# EasyEDA Pro project ProPrj_工创赛_2026-09-08.epro, board PCB1
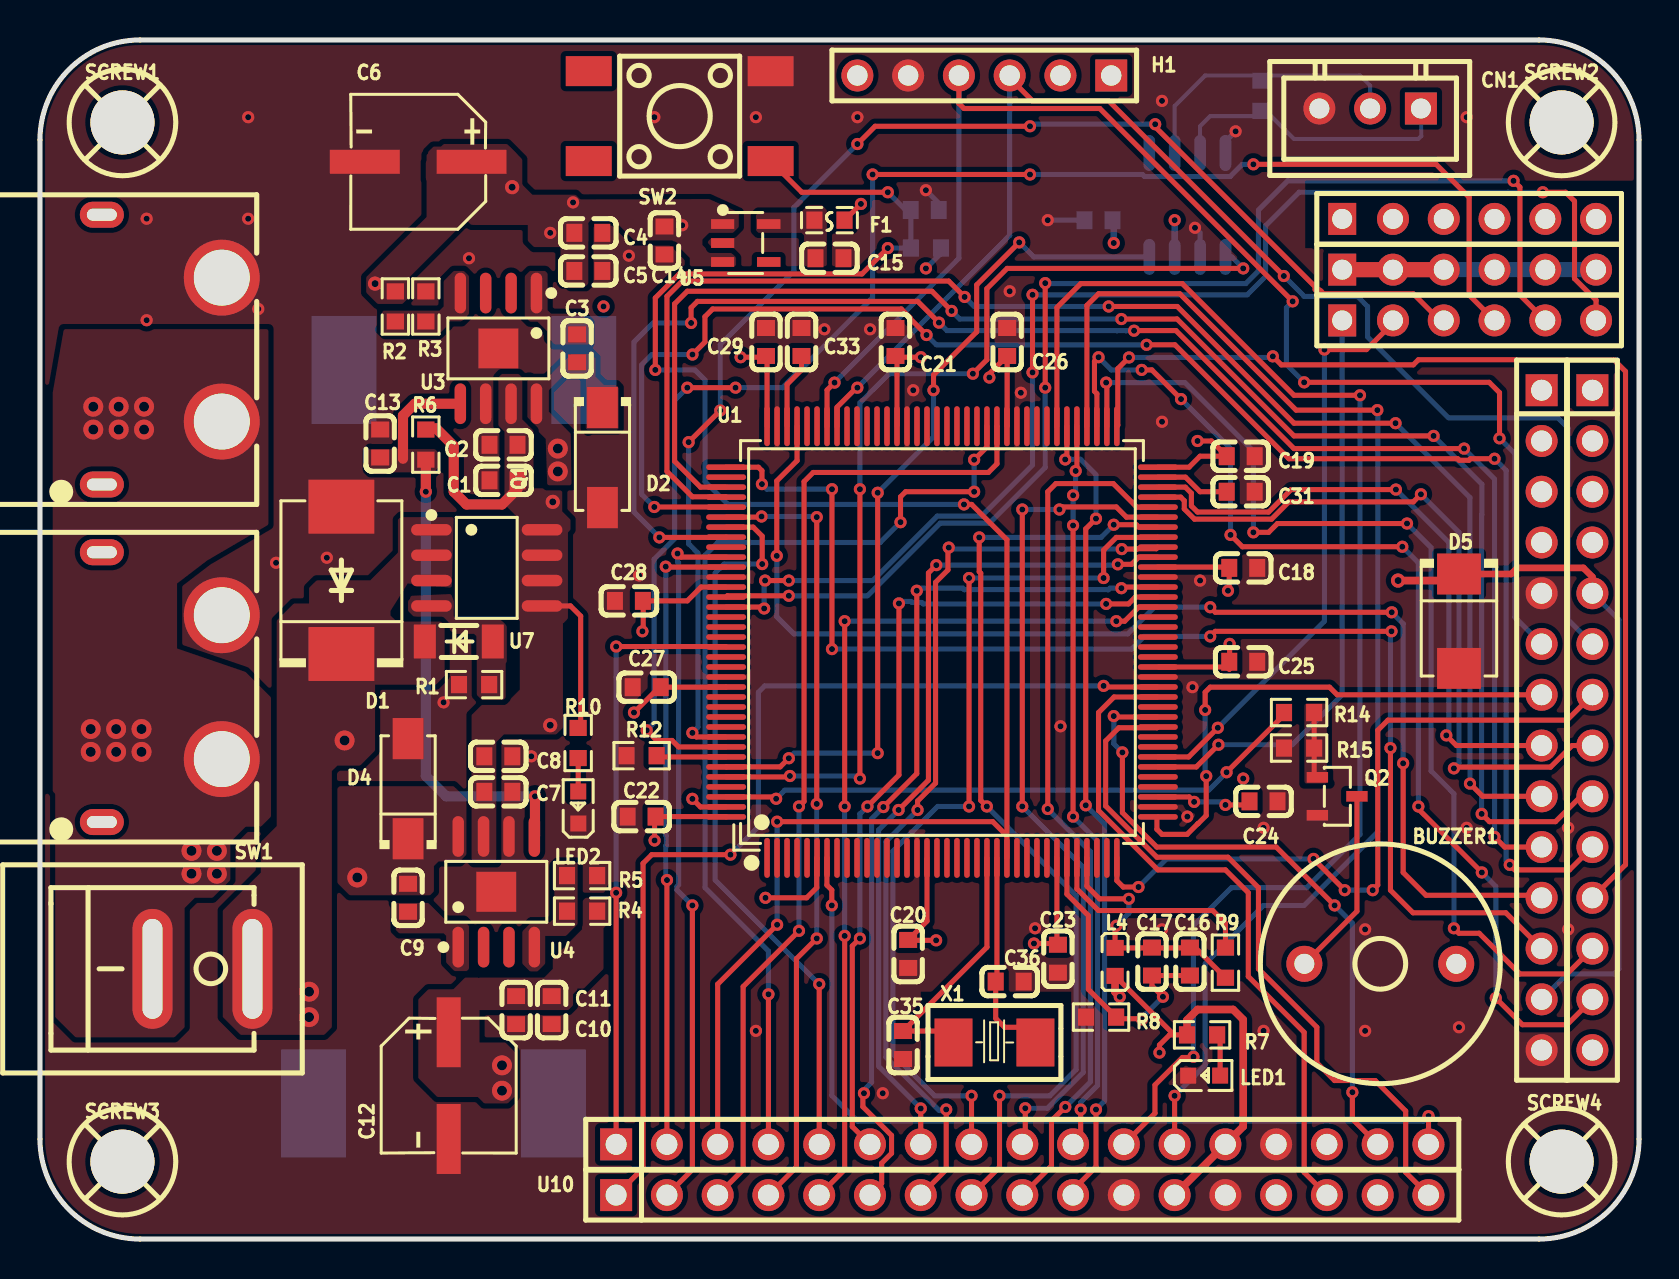
[diagram p3: board, top side]
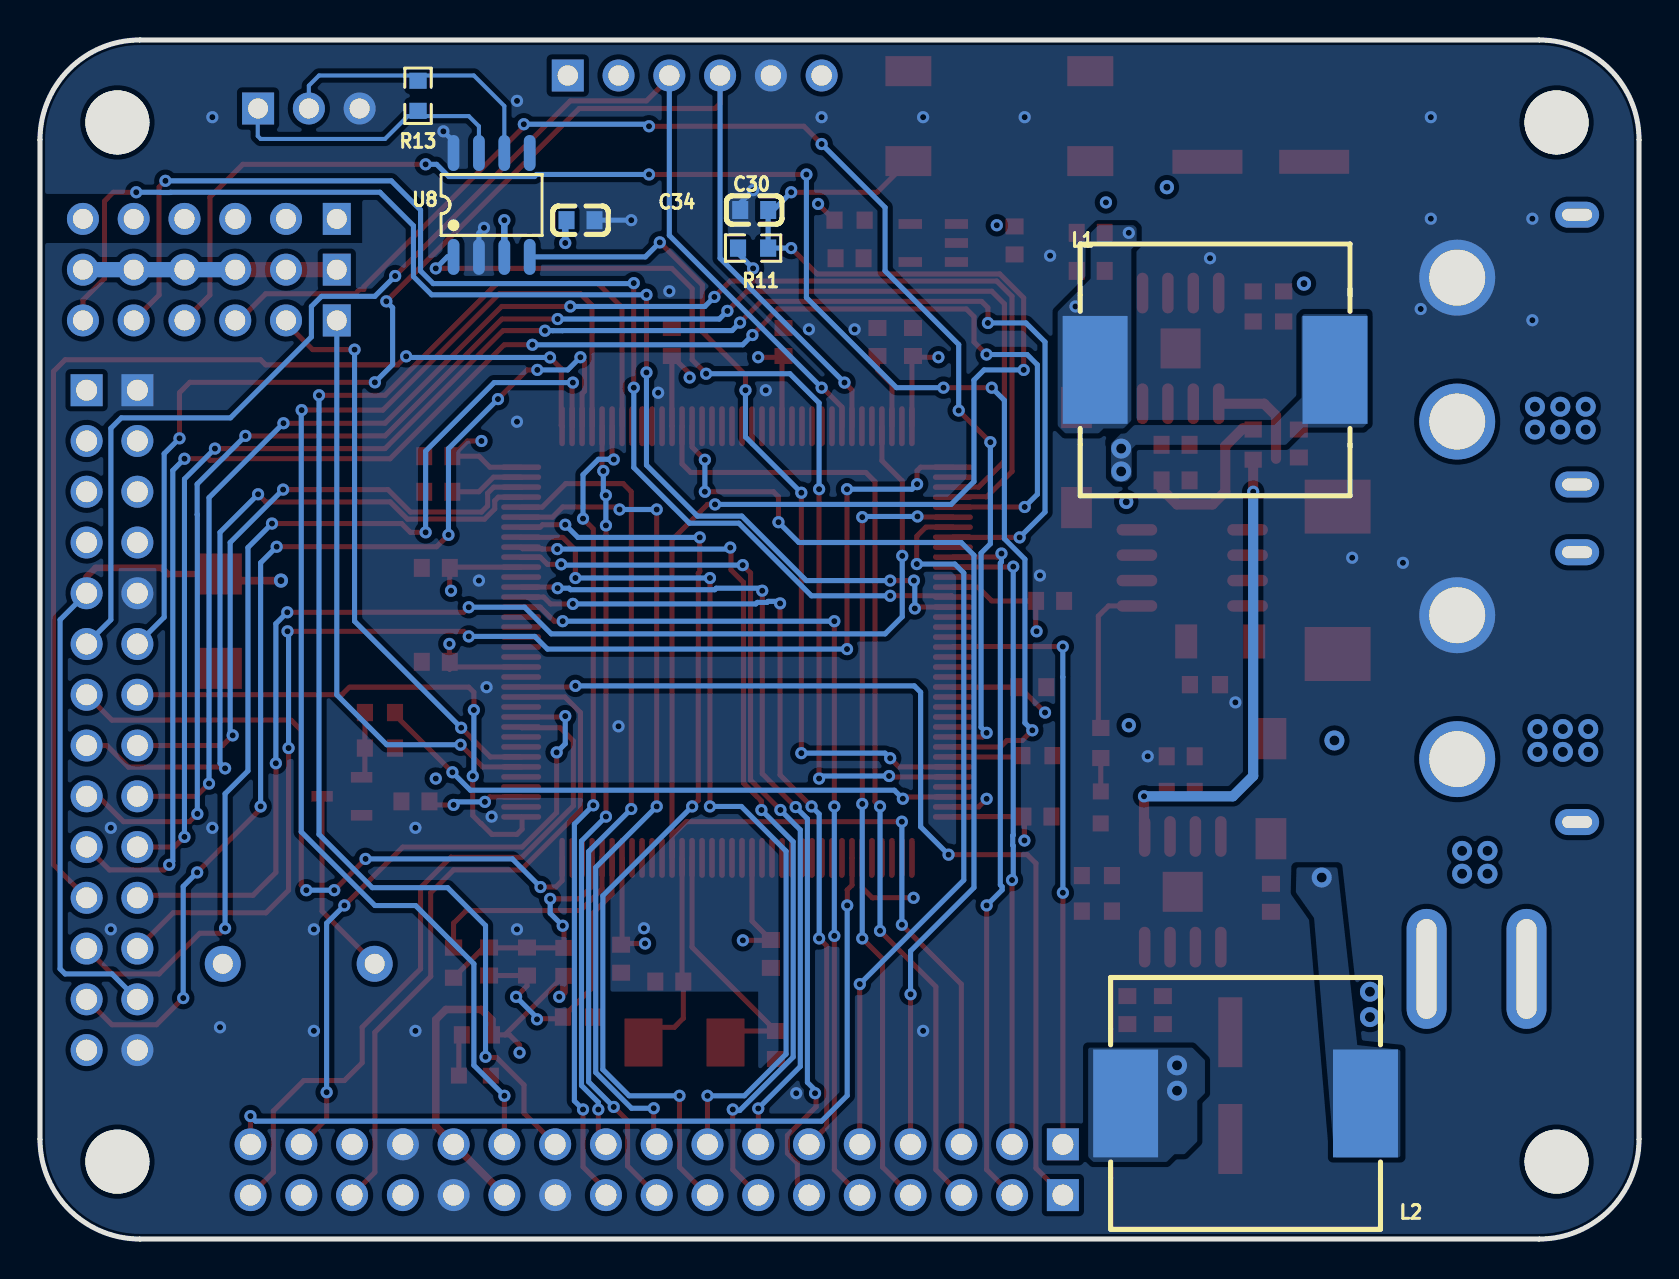
[diagram p4: board, bottom side, seen from below]

Outline 80 x 60 mm; copper layers: Top Layer, GND, POWER, Bottom Layer. Coordinates in mm from the lower left corner of the outline.
Outline path: 0,55 0,5 arc(1.46,1.46) 5,0 75,0 arc(78.54,1.46) 80,5 80,55 arc(78.54,58.54) 75,60 5,60 arc(1.46,58.54) 0,55
Stack: Top Layer 0.035mm Outer layer thickness 1oz / Dielectric1 0.2104mm 7628 RC49% 8.6mil / GND 0.0152mm Inner layer thickness / Dielectric2 1.065mm 1.1mm H/HOZ Copper / POWER 0.0152mm Inner layer thickness / Dielectric3 0.2104mm 7628 RC49% 8.6mil / Bottom Layer 0.035mm Outer layer thickness 1oz

## Design rules (mm)
spacing copperThickness1oz (default): track to track 0.102, other pairs 0.152 to 0.3
spacing copperThickness2oz: track to track 0.203, other pairs 0.152 to 0.3
track width copperThickness1oz (default): min 0.127, default 0.254, max 2.54
track width copperThickness2oz: min 0.203, default 0.254, max 2.54
differential pair differentialPair (default): width min 0.203, default 0.203, max 2.54; gap min 0.203, default 0.203
net GND-D uses copperRegion
net VIN-D uses copperRegion
net $1N20 uses copperRegion
net $1N19 uses copperRegion
net 5V uses copperRegion
net $1N35 uses copperRegion
net $1N36 uses copperRegion
net 5V_5A uses copperRegion
net EN_1 uses copperRegion
net $1N46 uses copperRegion
net $1N16 uses copperRegion
net FB1 uses copperRegion
net FB2 uses copperRegion
net VIN-P uses copperRegion

## Placement (name value [footprint] x y rotation side)
BUZZER1  2.4kHz  [BUZ-TH_BD12.0-P7.60-D0.6-FD]  67.06 13.77 180 top
C1  22uF  [C0603]  23.19 37.96 180 top
C2  0.1uF  [C0603]  23.19 39.74 180 top
C3  10nF  [C0603]  26.87 44.57 90 top
C4  22uF  [C0603]  27.43 50.35 180 top
C5  100nF  [C0603]  27.43 48.44 180 top
C6  220uF  [CAP-SMD_BD6.3-L6.6-W6.6-FD]  18.92 53.9 180 top
C7  22uF  [C0603]  22.93 22.38 0 top
C8  0.1uF  [C0603]  22.93 24.15 0 top
C9  10nF  [C0603]  18.42 17.07 270 top
C10  22uF  [C0603]  23.82 11.45 90 top
C11  100nF  [C0603]  25.6 11.45 90 top
C12  220uF  [CAP-SMD_BD6.3-L6.6-W6.6-FD]  20.45 7.68 270 top
C13  100nF  [C0603]  17.02 39.81 90 top
C14  1uF  [C0603]  31.24 49.97 90 top
C15  1uF  [C0603]  39.5 49.08 180 top
C16  1uF  [C0603]  57.53 13.88 90 top
C17  100nF  [C0603]  55.63 13.88 90 top
C18  100nF  [C0603]  60.2 33.58 180 top
C19  100nF  [C0603]  60.07 39.17 180 top
C20  100nF  [C0603]  43.43 14.27 90 top
C21  100nF  [C0603]  42.8 44.89 270 top
C22  100nF  [C0603]  30.1 21.14 0 top
C23  100nF  [C0603]  50.93 14.03 90 top
C24  100nF  [C0603]  61.21 21.9 180 top
C25  100nF  [C0603]  60.2 28.88 180 top
C26  100nF  [C0603]  48.39 44.89 270 top
C27  100nF  [C0603]  30.35 27.61 0 top
C28  100nF  [C0603]  29.46 31.93 0 top
C29  100nF  [C0603]  36.32 44.89 270 top
C30  100nF  [C0603]  44.27 51.49 0 bottom
C31  2.2uF  [C0603]  60.07 37.39 180 top
C33  2.2uF  [C0603]  38.1 44.89 270 top
C34  100nF  [C0603]  52.96 50.98 0 bottom
C35  20pF  [C0603]  43.18 9.71 90 top
C36  20pF  [C0603]  48.51 12.88 180 top
CN1  ZX-XH2.54-3PZZ  [CONN-TH_3P-P2.54_2501S-3P]  66.55 56.57 180 top
D1  SMCJ15A  [SMC_L6.9-W5.9-LS8.0-RD]  15.08 32.96 90 top
D2  SS54  [SMA_L4.4-W2.8-LS5.4-R-RD]  28.14 39.11 270 top
D4  SS54  [SMA_L4.4-W2.8-LS5.4-R-RD]  18.42 22.53 90 top
D5  SMBJ3.3A  [SMB_L4.6-W3.6-LS5.3-RD]  70.99 30.92 270 top
F1  BSMD0603-050-6V  [F0603]  39.5 50.98 0 top
H1  陀螺仪  [HDR-TH_PZ2.54-1X6PZZ-L11.5]  47.24 58.22 180 top
H2  LAIL-PZ2.54-6P-L  [CONN-TH_LAIL-PZ2.54-6P-L]  71.5 45.97 0 top
H3  LAIL-PZ2.54-6P-L  [CONN-TH_LAIL-PZ2.54-6P-L]  71.5 48.51 0 top
H4  LAIL-PZ2.54-6P-L  [CONN-TH_LAIL-PZ2.54-6P-L]  71.5 51.05 0 top
L1  FXL1350-150-M  [IND-SMD_L12.6-W13.5]  21.21 43.49 180 bottom
L2  FXL1350-150-M  [IND-SMD_L12.6-W13.5]  19.68 6.79 180 bottom
L4  BLM18PG121SN1D  [L0603]  53.79 13.87 90 top
LED1  -  [LED_0603]  58.29 8.18 0 top
LED2  -  [LED_0603]  26.92 21.65 90 top
Q1  AO4407A  [SOP-8_L5.0-W4.0-P1.27-LS6.0-BL]  22.35 33.58 270 top
Q2  S8050  [SOT-23-3_L2.9-W1.3-P1.90-LS2.3-BR]  64.9 22.15 180 top
R1  100K  [R0603]  21.72 27.74 0 top
R2  10K  [R0603]  17.78 46.66 90 top
R3  3.16K  [R0603]  19.3 46.66 270 top
R4  10K  [R0603]  27.12 16.41 0 top
R5  3.16K  [R0603]  27.12 18.19 180 top
R6  100K  [R0603]  19.3 39.75 90 top
R7  1K  [R0603]  58.14 10.22 0 top
R8  0  [R0603]  53.09 11.1 0 top
R9  0  [R0603]  59.31 13.83 90 top
R10  2.2K  [R0603]  26.92 24.82 270 top
R11  10K  [R0603]  44.32 49.59 0 bottom
R12  10K  [R0603]  30.1 24.19 0 top
R13  120  [R0603]  61.09 57.21 270 bottom
R14  1K  [R0603]  62.99 26.34 0 top
R15  10K  [R0603]  62.99 24.57 0 top
SCREW1  -  [M3螺丝]  4.13 55.87 0 top
SCREW2  -  [M3螺丝]  76.13 55.87 0 top
SCREW3  -  [M3螺丝]  4.13 3.87 0 top
SCREW4  -  [M3螺丝]  76.13 3.87 0 top
SW1  RS601HL-1010011BB  [SW-TH_RS601HL-1010011BB]  8.13 13.52 180 top
SW2  KH-6X6X5H-STM  [SW-SMD_4P-L6.0-W6.0-P4.50-LS9.0_H5.0]  32 56.19 180 top
U1  STM32F407ZGT6  [LQFP-144_L20.0-W20.0-P0.50-LS22.0-BL]  45.13 29.87 0 top
U2  XT60PW-F  [TH_2P-XT60PW-F]  6.1 27.61 90 top
U3  RT8289GSP  [SOIC-8_L5.0-W4.0-P1.27-LS6.0-BL-EP2.0]  22.93 44.57 180 top
U4  RT8289GSP  [SOIC-8_L5.0-W4.0-P1.27-LS6.0-BL-EP2.0]  22.83 17.37 0 top
U5  RT9013-33GB  [SOT-23-5_L3.0-W1.7-P0.95-LS2.8-BL]  35.31 49.84 270 top
U6  XT60PW-F  [TH_2P-XT60PW-F]  6.1 44.51 90 top
U7  ZMM12V  [LL-34_L3.5-W1.5-RD-2]  20.95 29.9 0 top
U8  SN65HVD230DR  [SOIC-8_L4.9-W3.9-P1.27-LS6.0-BL]  57.4 51.74 180 bottom
U10  PM254-1-17-Z-8.5  [HDR-TH_17P-P2.54-V-F]  49.14 2.2 0 top
U11  LAIL-PM2.54-14P-L  [HDR-TH_LAIL-PM2.54-14P-L]  77.67 25.96 270 top
U12  触摸屏  [HDR-TH_17P-P2.54-V-F]  49.14 4.74 0 top
U13  LAIL-PM2.54-14P-L  [HDR-TH_LAIL-PM2.54-14P-L]  75.13 25.96 270 top
X1  8MHz  [OSC-SMD_L5.0-W3.2]  47.75 9.83 180 top

## Footprints (pads in the part's own frame, mm; a bottom-side part is the same pattern mirrored in y, then rotated)
BUZ-TH_BD12.0-P7.60-D0.6-FD
  round 1.8 hole 1: 1(-3.8,0) 2(3.8,0)
C0603
  rect 0.8x0.9 smd: 1(-0.7,0) 2(0.7,0)
CAP-SMD_BD6.3-L6.6-W6.6-FD
  rect 3.5x1.2 smd: 1(-2.67,0) 2(2.67,0)
CONN-TH_3P-P2.54_2501S-3P
  rect 1.6x1.6 hole 1: 1(-2.54,0)
  round 1.6 hole 1: 2(0,0) 3(2.54,0)
CONN-TH_LAIL-PZ2.54-6P-L
  rect 1.4x1.6 hole 1: 1(-6.35,0)
  round 1.6 hole 1: 2(-3.81,0) 3(-1.27,0) 4(1.27,0) 5(3.81,0) 6(6.35,0)
F0603
  rect 0.806x0.864 smd: 1(-0.753,0) 2(0.753,0)
HDR-TH_17P-P2.54-V-F
  rect 1.6x1.6 hole 1.05: 1(-20.32,0)
  round 1.6 hole 1.05: 2(-17.78,0) 3(-15.24,0) 4(-12.7,0) 5(-10.16,0) 6(-7.62,0) 7(-5.08,0) 8(-2.54,0) 9(0,0) 10(2.54,0) 11(5.08,0) 12(7.62,0) 13(10.16,0) 14(12.7,0) 15(15.24,0) 16(17.78,0) 17(20.32,0)
HDR-TH_LAIL-PM2.54-14P-L
  rect 1.6x1.6 hole 1.05: 1(-16.51,0)
  round 1.6 hole 1.05: 2(-13.97,0) 3(-11.43,0) 4(-8.89,0) 5(-6.35,0) 6(-3.81,0) 7(-1.27,0) 8(1.27,0) 9(3.81,0) 10(6.35,0) 11(8.89,0) 12(11.43,0) 13(13.97,0) 14(16.51,0)
HDR-TH_PZ2.54-1X6PZZ-L11.5
  rect 1.6x1.6 hole 1.02: 1(-6.35,0)
  round 1.6 hole 1.02: 2(-3.81,0) 3(-1.27,0) 4(1.27,0) 5(3.81,0) 6(6.35,0)
IND-SMD_L12.6-W13.5
  rect 3.25x5.4 smd: 1(-6,0) 2(6,0)
L0603
  rect 0.8x0.864 smd: 1(-0.7,0) 2(0.7,0)
LED_0603
  rect 0.8x0.8 smd: 1(-0.851,-0.01) 2(0.75,-0.005)
LL-34_L3.5-W1.5-RD-2
  rect 1.1x1.7 smd: 1(-1.7,0) 2(1.7,0)
LQFP-144_L20.0-W20.0-P0.50-LS22.0-BL
  oval 0.28x2 smd: 1(-8.75,-10.8) 2(-8.25,-10.8) 3(-7.75,-10.8) 4(-7.25,-10.8) 5(-6.75,-10.8) 6(-6.25,-10.8) 7(-5.75,-10.8) 8(-5.25,-10.8) 9(-4.75,-10.8) 10(-4.25,-10.8) 11(-3.75,-10.8) 12(-3.25,-10.8) 13(-2.75,-10.8) 14(-2.25,-10.8) 15(-1.75,-10.8) 16(-1.25,-10.8) 17(-0.75,-10.8) 18(-0.25,-10.8) 19(0.25,-10.8) 20(0.75,-10.8) 21(1.25,-10.8) 22(1.75,-10.8) 23(2.25,-10.8) 24(2.75,-10.8) 25(3.25,-10.8) 26(3.75,-10.8) 27(4.25,-10.8) 28(4.75,-10.8) 29(5.25,-10.8) 30(5.75,-10.8) 31(6.25,-10.8) 32(6.75,-10.8) 33(7.25,-10.8) 34(7.75,-10.8) 35(8.25,-10.8) 36(8.75,-10.8) 73(8.75,10.8) 74(8.25,10.8) 75(7.75,10.8) 76(7.25,10.8) 77(6.75,10.8) 78(6.25,10.8) 79(5.75,10.8) 80(5.25,10.8) 81(4.75,10.8) 82(4.25,10.8) 83(3.75,10.8) 84(3.25,10.8) 85(2.75,10.8) 86(2.25,10.8) 87(1.75,10.8) 88(1.25,10.8) 89(0.75,10.8) 90(0.25,10.8) 91(-0.25,10.8) 92(-0.75,10.8) 93(-1.25,10.8) 94(-1.75,10.8) 95(-2.25,10.8) 96(-2.75,10.8) 97(-3.25,10.8) 98(-3.75,10.8) 99(-4.25,10.8) 100(-4.75,10.8) 101(-5.25,10.8) 102(-5.75,10.8) 103(-6.25,10.8) 104(-6.75,10.8) 105(-7.25,10.8) 106(-7.75,10.8) 107(-8.25,10.8) 108(-8.75,10.8)
  oval 2x0.28 smd: 37(10.8,-8.75) 38(10.8,-8.25) 39(10.8,-7.75) 40(10.8,-7.25) 41(10.8,-6.75) 42(10.8,-6.25) 43(10.8,-5.75) 44(10.8,-5.25) 45(10.8,-4.75) 46(10.8,-4.25) 47(10.8,-3.75) 48(10.8,-3.25) 49(10.8,-2.75) 50(10.8,-2.25) 51(10.8,-1.75) 52(10.8,-1.25) 53(10.8,-0.75) 54(10.8,-0.25) 55(10.8,0.25) 56(10.8,0.75) 57(10.8,1.25) 58(10.8,1.75) 59(10.8,2.25) 60(10.8,2.75) 61(10.8,3.25) 62(10.8,3.75) 63(10.8,4.25) 64(10.8,4.75) 65(10.8,5.25) 66(10.8,5.75) 67(10.8,6.25) 68(10.8,6.75) 69(10.8,7.25) 70(10.8,7.75) 71(10.8,8.25) 72(10.8,8.75) 109(-10.8,8.75) 110(-10.8,8.25) 111(-10.8,7.75) 112(-10.8,7.25) 113(-10.8,6.75) 114(-10.8,6.25) 115(-10.8,5.75) 116(-10.8,5.25) 117(-10.8,4.75) 118(-10.8,4.25) 119(-10.8,3.75) 120(-10.8,3.25) 121(-10.8,2.75) 122(-10.8,2.25) 123(-10.8,1.75) 124(-10.8,1.25) 125(-10.8,0.75) 126(-10.8,0.25) 127(-10.8,-0.25) 128(-10.8,-0.75) 129(-10.8,-1.25) 130(-10.8,-1.75) 131(-10.8,-2.25) 132(-10.8,-2.75) 133(-10.8,-3.25) 134(-10.8,-3.75) 135(-10.8,-4.25) 136(-10.8,-4.75) 137(-10.8,-5.25) 138(-10.8,-5.75) 139(-10.8,-6.25) 140(-10.8,-6.75) 141(-10.8,-7.25) 142(-10.8,-7.75) 143(-10.8,-8.25) 144(-10.8,-8.75)
M3螺丝
  round 3.2 hole 3.2: 1(0,0)
OSC-SMD_L5.0-W3.2
  rect 1.9x2.4 smd: 1(-2.05,0) 2(2.05,0)
R0603
  rect 0.806x0.864 smd: 1(-0.753,0) 2(0.753,0)
SMA_L4.4-W2.8-LS5.4-R-RD
  rect 2.062x1.539 smd: 1(2.503,0) 2(-2.503,0)
SMB_L4.6-W3.6-LS5.3-RD
  rect 2.047x2.192 smd: 1(-2.361,0) 2(2.361,0)
SMC_L6.9-W5.9-LS8.0-RD
  rect 2.7x3.3 smd: 1(-3.687,0) 2(3.687,0)
SOIC-8_L4.9-W3.9-P1.27-LS6.0-BL
  oval 0.588x1.8 smd: 1(-1.905,-2.6) 2(-0.635,-2.6) 3(0.635,-2.6) 4(1.905,-2.6) 5(1.905,2.6) 6(0.635,2.6) 7(-0.635,2.6) 8(-1.905,2.6)
SOIC-8_L5.0-W4.0-P1.27-LS6.0-BL-EP2.0
  oval 0.574x2.038 smd: 1(-1.905,-2.769) 2(-0.635,-2.769) 3(0.635,-2.769) 4(1.905,-2.769) 5(1.905,2.769) 6(0.635,2.769) 7(-0.635,2.769) 8(-1.905,2.769)
  rect 2x2 smd: 9(0,0)
SOP-8_L5.0-W4.0-P1.27-LS6.0-BL
  oval 0.574x2.035 smd: 1(-1.905,-2.768) 2(-0.635,-2.768) 3(0.635,-2.768) 4(1.905,-2.768) 5(1.905,2.768) 6(0.635,2.768) 7(-0.635,2.768) 8(-1.905,2.768)
SOT-23-3_L2.9-W1.3-P1.90-LS2.3-BR
  rect 1.07x0.532 smd: 1(0.99,-0.95) 2(0.99,0.95) 3(-0.99,0)
SOT-23-5_L3.0-W1.7-P0.95-LS2.8-BL
  rect 0.49x1.157 smd: 1(-0.95,-1.153) 2(0,-1.153) 3(0.95,-1.153)
  rect 0.49x1.175 smd: 4(0.95,1.153) 5(-0.95,1.153)
SW-SMD_4P-L6.0-W6.0-P4.50-LS9.0_H5.0
  rect 2.3x1.5 smd: 1(-4.55,2.25) 2(4.55,2.25) 3(-4.55,-2.25) 4(4.55,-2.25)
SW-TH_RS601HL-1010011BB
  oval 2x6 hole 1x5: 1(-2.5,0) 2(2.5,0)
TH_2P-XT60PW-F
  oval 1.3x2.2 hole 0.6x1.5: 1(-6.75,3) 2(6.75,3)
  round 3.8 hole 2.8: 3(-3.6,-3) 4(3.6,-3)

## Nets
As in the schematic.

Pads without a net: H1 1 6; SCREW1 1; SCREW2 1; SCREW3 1; SCREW4 1; SW2 2 4; U1 1 2 3 4 5 8 9 10 11 12 13 14 15 18 19 20 21 22 26 27 28 29 34 35 40 41 44 45 48 53 54 55 56 57 80 81 82 87 88 89 90 91 92 93 96 97 98 99 100 103 104 110 117 124 125 126 128 129 132 133 134 135 141; U2 1 2; U3 2 3; U4 2 3; U5 4; U6 1 2; U8 5; U10 16; U11 14; U12 15

## Via types
v1: diameter 0.61, hole 0.305, Top Layer to Bottom Layer, 251 vias
v2: diameter 0.711, hole 0.355, Top Layer to Bottom Layer, 5 vias
v3: diameter 1, hole 0.5, Top Layer to Bottom Layer, 24 vias

## Routing (per net, layer and track width the routed paths; a pad name or vN(x,y) marks a point on that pad's centre or on a via; arc(x,y) is an arc through that point)
3.3V: length 129.7
  Top Layer w0.254: L4.1 56.74,10.22 ; 56.74,10.22 56.52,10.22 56.01,9.71 v1(56.01,9.33) ; 56.74,10.22 R7.1 ; v1(49.73,14.79) 50.86,14.79 50.88,14.78 ; U1.52 59.24,28.62 C25.2 ; 59.5,28.5 59.52,28.52 v1(59.52,29.78) ; U1.30 50.88,14.78 ; 50.88,14.78 50.93,14.73 ; v1(59.44,32.44) 59.5,32.5 C18.2 59.46,33.62 U1.62 ; v1(41.07,51.8) 40.26,50.98 F1.2 ; U1.6 38.86,19.06 38.86,17.58 38.35,17.07 v1(36.3,17.07) ; U1.84 48.39,40.68 C26.2 47.5,43.3 v1(47.5,43.11) ; v1(30.75,19.94) 30.75,21.09 C22.2 34.31,21.14 U1.144 ; U1.143 33.04,21.62 v1(32.64,22.03) ; C21.2 42.86,44.12 ; 42.86,44.12 42.88,44.11 U1.95 ; 42.86,44.12 v1(44.07,44.12) ; v1(59.31,21.72) 60.34,21.72 C24.2 ; U1.72 57.49,38.62 58.04,39.17 C19.2 58.61,39.93 v1(57.91,39.93) ; U1.108 36.38,44.13 C29.2 36.26,44.12 v1(35.05,44.12) ; v1(29.72,26.34) 30.99,27.61 C27.2 34.32,27.61 U1.131 ; U1.121 33.08,32.62 32.39,31.93 30.18,31.93 30.18,30.41 ; U1.17 44.38,15.91 C20.2 43.45,14.95 v1(44.83,14.95) ; U1.39 57.49,22.12 v1(57.74,21.87)
  Top Layer w0.33: D5.1 73.61,33.28 73.91,33.58 77.22,33.58 77.67,33.13 U11.5
  Top Layer w0.381: R7.1 57.39,10.96 57.91,11.49 59.69,11.49 60.2,10.98 60.2,5.63 U12.13 U10.12 ; D5.1 70.66,32.95 v2(67.95,32.95) ; v1(54.02,12.12) 53.79,12.36 L4.1
  Bottom Layer w0.254: v1(59.31,21.72) 59.16,21.87 v1(57.74,21.87) ; U13.13 76.4,13.26 78.74,13.26 78.99,13.52 78.99,30.99 U11.5 ; R11.2 45.08,49.32 v1(44.32,48.57)
  Bottom Layer w0.33: C34.2 53.72,50.92 v1(53.72,49.84) ; v1(56.77,50.98) U8.3
  vias: v1(30.14,30.41) v1(60.2,23.04)
5V: length 12.7
  Top Layer w0.762: H3.1 H3.2 H3.3
  Bottom Layer w0.762: H3.6 H3.5 H3.4 H3.3
  vias: v1(25.53,50.35) v1(26.67,51.87) v1(28.19,46.66) v1(32.13,50.73) v2(16.76,47.81) v2(23.62,52.63)
5V_5A:
  vias: v3(23.11,8.69) v3(23.11,7.42)
GND-D: length 6
  Bottom Layer w0.254: v1(57.78,50.6) 58.04,50.35 U8.2 ; v1(59.82,55.43) 59.31,54.92 U8.8 ; v1(50.42,50.98) C34.1 ; v1(44.32,52.48) 44.97,51.84 C30.2
  vias: v1(5.34,51.06) v1(5.34,45.98) v1(10.42,56.14) v1(10.42,51.06) v1(10.92,46.54) v1(11.81,33.84) v1(14.35,34.09) v1(20.19,26.85) v1(21.46,49.08) v1(24.58,24.15) v1(29.46,49.2) v1(29.97,33.2) v1(30.74,56.14) v1(35.82,56.14) v1(35.82,10.42) v1(39.24,45.52) v1(40.9,56.14) v1(41.53,45.52) v1(42.16,7.29) v1(43.69,42.47) v1(48.51,47.43) v1(49.07,42.35) v1(49.78,15.55) v1(51.06,25.66) v1(56.13,56.95) v1(56.14,40.9) v1(56.14,15.5) v1(57.4,21.14) v1(57.66,27.61) v1(58.04,32.95) v1(61.22,20.58) v1(61.22,10.42) v1(66.3,15.5) v1(66.3,10.42) v1(70.99,10.6) v1(71.38,56.14) v1(71.38,20.58) v1(76.46,20.58) v1(76.46,15.5)
VDDA: length 12.7
  Top Layer w0.254: U1.33 52.38,17.66 53.01,17.02 v1(54.48,17.02) ; R9.1 57.8,14.58 C16.2 57.51,14.57 L4.2 53.79,15.61 v1(53.85,15.68)
  Bottom Layer w0.254: v1(53.85,15.68) 54.48,16.3 v1(54.48,17.02)
VIN-D: length 16
  Top Layer w0.254: Q1.5 26.54,31.68 27.05,31.17 27.05,25.7 R10.1
  Top Layer w0.508: 19.3,40.56 19.82,40.56 20.7,39.68 20.7,37.39 21.34,36.76 23.11,36.76 23.89,37.53 C1.1
  vias: v2(25.53,25.71) v2(25.65,36.89)
VIN-P:
  vias: v3(2.54,25.52) v3(2.54,24.38) v3(2.67,41.65) v3(2.67,40.51) v3(3.81,25.52) v3(3.81,24.38) v3(3.94,41.65) v3(3.94,40.51) v3(5.08,25.52) v3(5.08,24.38) v3(5.21,41.65) v3(5.21,40.51) v3(7.58,19.42) v3(7.58,18.28) v3(8.85,19.42) v3(8.85,18.28)
VSSA: length 15.1
  Top Layer w0.254: C16.1 C17.1 55.63,12.67 v1(56.18,12.12) ; 55.16,11.02 53.92,11.02 R8.2 52.45,12.49 52.45,16.18 51.38,17.26 U1.31
  Bottom Layer w0.254: 55.16,11.02 55.16,11.1 v1(56.18,12.12)
  vias: v1(55.13,10.99)
BOOT0: length 3.5
  Top Layer w0.254: R12.2 30.92,24.12 U1.138
EN_1: length 29
  Top Layer w0.508: 18.16,39.04 18.16,41.2 18.75,41.8 U3.5 ; R6.1 v1(19.3,37.39) ; U4.5 24.77,20.18 v1(24.77,22.15)
  Bottom Layer w0.508: v1(19.3,37.39) 19.3,23.17 20.32,22.15 v1(24.77,22.15)
NRST: length 96.5
  Top Layer w0.254: v1(42.42,49.59) 41.12,48.29 31.98,48.29 30.78,47.09 v1(30.78,43.49) ; v1(36.88,15.73) 33.9,12.75 U12.3 ; SW2.1 38.11,52.38 v1(42.42,52.38) ; v1(46.23,36.76) 46.61,36.76 48.38,34.99 48.38,20.17 ; 48.38,20.17 47.67,20.88 v1(36.88,20.88) ; 48.38,20.17 U1.25
  Bottom Layer w0.254: v1(36.88,15.73) v1(36.88,20.88) ; v1(46.23,36.76) 34.42,36.76 33.27,37.9 33.27,42.98 32.77,43.49 v1(30.78,43.49) ; v1(42.42,49.59) R11.1 43.57,51.49 C30.1 43.31,51.49 v1(42.42,52.38)
PA2: length 34.9
  Top Layer w0.254: v1(65.28,17.45) v1(63.71,19.02) ; v1(54.96,17.61) 54.2,17.61 53.88,17.93 U1.36 ; v1(66.67,17.45) 66.93,17.71 66.93,25.46 67.44,25.96 76.4,25.96 U11.7
  Bottom Layer w0.254: v1(66.67,17.45) v1(65.28,17.45) ; v1(54.96,17.61) 56.36,19.02 v1(63.71,19.02)
PA3: length 26.9
  Top Layer w0.254: v1(58.35,23.16) 58.35,21.19 57.94,20.78 57.92,20.78 57.39,20.25 56.13,20.25 55.88,20.5 55.88,21.08 U1.37 ; v1(58.29,26.47) 58.29,27.36 58.55,27.61 64.52,27.61 64.9,27.23 U13.7
  Bottom Layer w0.254: v1(58.35,23.16) 58.29,23.22 v1(58.29,26.47)
PA6: length 29.5
  Top Layer w0.254: v1(58.96,24.73) 57.85,23.62 U1.42
  Bottom Layer w0.254: H2.1 65.15,27.23 62.65,24.73 v1(58.96,24.73)
PA7: length 28.9
  Top Layer w0.254: U1.43 57.47,24.12 v1(58.93,25.58) ; H2.2 67.75,45.9 66.36,44.51 v1(64.26,44.51)
  Bottom Layer w0.254: v1(58.93,25.58) 64.26,30.92 v1(64.26,44.51)
PA9: length 68.7
  Top Layer w0.254: U1.101 39.88,41.63 40.85,42.6 v1(40.89,42.6) ; v1(62.23,48.19) 53.47,56.95 49.66,56.95 48.51,58.09 H1.3
  Bottom Layer w0.254: U11.6 76.45,30.99 76.45,40.57 75.93,41.09 70.47,41.09 66.42,45.14 66.42,46.66 65.91,47.17 63.25,47.17 v1(62.23,48.19) ; v1(40.89,42.6) 48.51,50.22 H1.3
PA10: length 70.5
  Top Layer w0.254: 45.97,58.22 45.97,56.82 46.23,56.57 53.02,56.57 v1(62.67,46.92) ; U1.102 39.38,42.48 v1(39.75,42.85) ; v1(63.25,42.87) 72.5,42.87 73.02,42.35 v1(73.02,40.07)
  Bottom Layer w0.254: v1(39.75,42.85) 45.97,49.08 45.97,58.22 ; v1(62.67,46.92) 62.36,46.6 62.36,43.76 v1(63.25,42.87) ; U13.6 73.79,31.11 73.79,39.3 v1(73.02,40.07)
PB0: length 35.6
  Top Layer w0.254: U1.46 55.89,25.58 53.98,25.58 53.31,24.92 53.31,21.67 55.88,19.11 59.44,19.11 60.96,17.58 60.96,13.52 63.88,10.6 63.88,8.82 64.77,7.93 66.8,7.93 68.33,6.41 68.33,3.34 U10.17
PB1: length 32.6
  Top Layer w0.254: v1(65.66,7.35) 65.66,6 U12.16 ; v1(54.15,24.35) 54.15,21.34 55.88,19.61 61.85,19.61 v1(64.77,16.69) ; v1(53.72,26.17) 53.77,26.12 U1.47
  Bottom Layer w0.254: v1(53.72,26.17) 53.72,24.78 v1(54.15,24.35) ; v1(65.66,7.35) 65.66,15.8 v1(64.77,16.69)
PB6: length 69
  Top Layer w0.254: U1.136 32.84,25.12 v1(32.64,25.33) ; v1(49.53,55.68) 41.78,55.68 v1(40.89,54.79) ; v1(55.79,55.78) 55.79,55.65 63.8,47.65 63.8,47.51 arc(64.03,47.49) 64.18,47.3 68.71,47.3 70.04,45.97 H2.3 ; v1(34.04,41.46) v1(32.45,39.87)
  Bottom Layer w0.254: v1(32.64,25.33) 32.92,25.61 32.92,34.32 32.45,34.79 v1(32.45,39.87) ; v1(40.89,54.79) 37.72,51.62 37.72,48.44 34.04,44.76 v1(34.04,41.46) ; v1(55.79,55.78) 49.63,55.78 v1(49.53,55.68)
PB7: length 77.1
  Top Layer w0.254: v1(30.35,25.46) 30.86,24.95 31.62,24.95 31.95,24.62 U1.137 ; v1(60.71,53.78) 69.85,53.78 71.5,52.13 71.5,47.24 H2.4 ; v1(34.8,42.6) v1(32.39,42.6) ; v1(49.53,53.27) v1(41.66,53.27)
  Bottom Layer w0.254: v1(32.39,42.6) 31.75,41.97 31.75,35.04 30.72,34.02 30.72,25.83 v1(30.35,25.46) ; v1(41.66,53.27) 41.66,47.11 37.15,42.6 v1(34.8,42.6) ; v1(49.53,53.27) 55.16,53.27 55.26,53.17 59.55,53.17 60.16,53.78 v1(60.71,53.78)
PB8: length 43.2
  Top Layer w0.254: v1(48.99,49.87) 46.86,47.74 46.86,45.39 44.7,43.24 v1(44.7,42.47) ; v1(41.91,24.31) v1(41.91,37.34) ; U1.139 34.33,23.63 37.03,23.63 v1(37.46,24.06)
  Bottom Layer w0.254: U8.4 49.72,49.14 v1(48.99,49.87) ; v1(44.7,42.47) 44.7,40.14 v1(41.91,37.34) ; v1(37.46,24.06) 37.72,24.31 v1(41.91,24.31)
PB9: length 50.7
  Top Layer w0.254: v1(37.52,23.17) 37.47,23.12 U1.140 ; v1(46.67,43.3) 47.37,44 47.37,47.55 48.39,48.57 v1(60.2,48.57) ; v1(41.02,37.52) v1(41.02,23.04)
  Bottom Layer w0.254: U8.1 59.62,49.14 v1(60.2,48.57) ; v1(37.52,23.17) 40.89,23.17 v1(41.02,23.04) ; v1(46.67,43.3) 42.48,43.3 41.02,41.84 v1(41.02,37.52)
PB10: length 36.4
  Top Layer w0.254: U1.69 57.07,37.12 57.25,36.94 57.25,36.53 57.76,36.02 61.62,36.02 62.48,36.89 68.71,36.89 v1(69.09,37.27) ; v1(70.74,23.55) 70.8,23.61 75.57,23.61 76.65,24.69 U11.8
  Bottom Layer w0.254: v1(69.09,37.27) 70.99,35.36 70.99,23.8 v1(70.74,23.55)
PB11: length 31.7
  Top Layer w0.254: v1(70.36,25.2) 70.87,24.69 U13.8 ; U1.70 57.3,37.62 57.61,37.32 57.61,36.68 57.91,36.38 61.47,36.38 62.59,37.5 v1(67.84,37.5)
  Bottom Layer w0.254: v1(67.84,37.5) 70.48,34.85 70.48,25.33 v1(70.36,25.2)
PB12: length 56.1
  Top Layer w0.254: U1.73 53.92,40.72 53.92,43.55 v1(54.48,44.11) ; U11.11 79.32,18.73 79.32,43.41 78.74,44 68.96,44 68.71,43.74 62.1,43.74 v1(61.68,44.17)
  Bottom Layer w0.254: v1(61.68,44.17) 61.62,44.11 v1(54.48,44.11)
PB13: length 52.5
  Top Layer w0.254: v1(53.34,42.85) 53.38,42.82 U1.74 ; U11.12 76.4,13.26 74.04,13.26 72,15.3 70.99,15.3 v1(70.74,15.55) ; v1(68.39,35.8) 61.91,35.8 61.47,35.36 v1(60.71,35.36)
  Bottom Layer w0.254: v1(53.34,42.85) 57.28,42.85 60.71,39.43 v1(60.71,35.36) ; v1(70.74,15.55) 70.74,22.28 69.6,23.42 69.6,34.6 v1(68.39,35.8)
PB14: length 55.7
  Top Layer w0.254: v1(68.96,21.65) 68.96,21.52 v1(72.14,18.34) ; U11.13 76.4,10.72 74.17,10.72 v1(72.83,12.06) ; U1.75 52.88,42.3 52.76,42.42 52.76,43.92 v1(52.96,44.12) ; v1(55.12,43.49) 55.63,43.49 v1(57.09,42.03) ; v1(68.16,34.64) 60.16,34.64 v1(59.56,35.23)
  Bottom Layer w0.254: v1(72.14,18.34) 72.83,17.65 v1(72.83,12.06) ; v1(68.96,21.65) 68.96,33.84 v1(68.16,34.64) ; v1(59.56,35.23) 59.56,39.55 v1(57.09,42.03) ; v1(55.12,43.49) 53.6,43.49 v1(52.96,44.12)
PB15: length 65.4
  Top Layer w0.254: U1.76 52.38,46.72 52.96,47.3 57.02,47.3 62.84,41.48 v1(66.91,41.48) ; U12.12 v1(56.77,7.17)
  Bottom Layer w0.254: v1(66.91,41.48) 66.93,41.46 66.93,20.38 63.24,16.69 61.21,16.69 58.29,13.77 58.29,8.7 v1(56.77,7.17)
PC10: length 78.4
  Top Layer w0.254: U1.111 33.05,37.62 31.75,38.92 31.75,46.79 32.39,47.43 44.62,47.43 v1(45.61,46.44) ; U11.9 77.09,22.15 75.82,20.88 72.52,20.88 v1(72.13,21.27) ; v1(69.72,40.19) 62.74,40.19 56.89,46.04 v1(54.1,46.04)
  Bottom Layer w0.254: v1(45.61,46.44) 46.02,46.04 v1(54.1,46.04) ; v1(72.13,21.27) 72.13,36.24 72.14,36.25 72.14,37.77 v1(69.72,40.19)
PC11: length 75.4
  Top Layer w0.254: v1(53.47,46.66) 56.9,46.66 62.74,40.82 v1(67.82,40.82) ; U13.9 72.18,22.15 v1(71.54,22.79) ; v1(46.26,47.14) 45.47,47.93 32.13,47.93 31.37,47.17 31.37,38.41 32.64,37.14 34.31,37.14 U1.112
  Bottom Layer w0.254: v1(67.82,40.82) 71.54,37.1 v1(71.54,22.79) ; v1(46.26,47.14) 46.74,46.66 v1(53.47,46.66)
PC12: length 84.1
  Top Layer w0.254: v1(55.36,44.75) 56.78,44.75 62.48,39.04 70.93,39.04 71,38.97 71.49,38.97 71.56,39.04 v1(72.77,39.04) ; U1.113 34.32,36.63 v1(30.73,36.63) ; v1(44.36,45.24) 43.53,46.06 43.53,46.1 43.09,46.54 33.65,46.54 33.27,46.15 33.27,44.89 v1(32.64,44.26) ; U11.10 76.52,18.47 73.79,18.47 v1(73.53,18.72)
  Bottom Layer w0.254: v1(32.64,44.26) 30.62,44.26 30.1,43.74 30.1,37.27 30.73,36.63 ; v1(55.36,44.75) 44.84,44.75 v1(44.36,45.24) ; v1(73.53,18.72) 73.36,18.9 73.36,38.46 v1(72.77,39.04)
PC13: length 43.9
  Top Layer w0.254: v1(69.47,6.15) 69.47,4.74 U12.17 ; U1.7 39.37,19.07 39.37,17.71 39.61,17.46 v1(39.61,16.69)
  Bottom Layer w0.254: v1(39.61,16.69) 39.61,7.18 40.89,5.9 69.21,5.9 v1(69.47,6.15)
PD0: length 39.5
  Top Layer w0.254: v1(38.86,21.77) v1(38.86,36.12) ; U10.4 37.85,3.6 37.85,14.03 v1(38.86,15.04) ; 34.33,36.12 36.07,36.12 v1(36.1,36.16)
  Bottom Layer w0.254: v1(38.86,36.12) 38.83,36.16 v1(36.1,36.16) ; v1(38.86,15.04) v1(38.86,21.77)
PD1: length 36.7
  Top Layer w0.254: U1.115 35.68,35.62 36.13,35.17 v1(36.13,33.77) ; U12.5 v1(38.98,12.76)
  Bottom Layer w0.254: v1(38.98,12.76) 33.78,17.96 33.78,33.33 34.23,33.77 v1(36.13,33.77)
PD2: length 82.2
  Top Layer w0.254: U1.116 34.31,35.11 v1(30.99,35.11) ; v1(32.58,45.84) 32.58,46.6 32.89,46.92 43.91,46.92 v1(44.98,45.86) ; 54.74,45.46 56.83,45.46 62.74,39.55 v1(71.25,39.55) ; U13.10 73.28,19.61 v1(72.77,20.12)
  Bottom Layer w0.254: v1(30.99,35.11) 29.72,36.38 29.72,44.89 30.67,45.84 v1(32.58,45.84) ; v1(71.25,39.55) 72.77,38.03 v1(72.77,20.12) ; v1(44.98,45.86) 45.37,45.46 53.85,45.46 53.86,45.45 54.34,45.45 54.35,45.46 54.74,45.46
  vias: v1(54.74,45.45)
PD4: length 35.5
  Top Layer w0.254: v1(32.64,16.69) 32.64,3.47 U10.2 ; v1(31.9,34.3) 32.08,34.12 U1.118
  Bottom Layer w0.254: v1(31.9,34.3) 31.9,33.88 31.95,33.83 31.95,17.72 31.86,17.63 31.86,17.47 v1(32.64,16.69)
PD5: length 32
  Top Layer w0.254: v1(31.31,33.65) 31.33,33.62 U1.119 ; U12.2 31.36,17.96 v1(31.37,17.96)
  Bottom Layer w0.254: v1(31.31,33.65) 31.31,20.21 31.33,20.18 31.33,19.7 31.31,19.67 31.31,18.02 v1(31.37,17.96)
PD6: length 62.8
  Top Layer w0.254: v1(73.72,52.95) 74.04,52.63 74.04,47.24 H2.5 ; 50.29,47.78 v1(50.29,42.6) ; v1(37.46,32.19) 34.39,32.19 U1.122
  Bottom Layer w0.254: 50.29,47.78 50.32,47.81 60.33,47.81 60.96,48.44 60.96,51.49 62.42,52.95 v1(73.72,52.95) ; v1(37.46,32.19) 41.4,32.19 45.03,35.82 47.51,35.82 50.29,38.6 v1(50.29,42.6)
  vias: v1(50.29,47.83)
PD7: length 65
  Top Layer w0.254: U1.123 36.16,31.62 v1(36.23,31.55) ; H2.6 77.85,46.98 76.77,48.06 76.77,51.93 76.33,52.38 v1(75.18,52.38) ; v1(37.46,32.95) v1(36.28,32.95) ; v1(49.66,47.25) v1(49.66,43.36)
  Bottom Layer w0.254: v1(75.18,52.38) 73.98,52.38 73.97,52.37 73.48,52.37 73.47,52.38 62.99,52.38 61.32,50.7 61.32,48.16 60.4,47.25 v1(49.66,47.25) ; v1(36.28,32.95) 36.23,32.9 v1(36.23,31.55) ; v1(49.66,43.36) 49.66,38.73 47.11,36.17 44.89,36.17 41.66,32.95 v1(37.46,32.95)
PD8: length 37
  Top Layer w0.254: U12.10 52.07,5.12 v1(52.07,6.48) ; U1.77 51.88,38.49 v1(51.82,38.43) ; v1(51.68,21.14) v1(51.68,35.71)
  Bottom Layer w0.254: v1(52.07,6.48) 52.07,6.84 52.91,7.68 52.91,19.91 v1(51.68,21.14) ; v1(51.82,38.43) 51.82,37.34 v1(51.69,37.22) 51.69,35.71 v1(51.68,35.71)
PD9: length 40.9
  Top Layer w0.254: v1(52.83,36.05) 52.32,35.54 v1(52.32,21.7) ; U1.78 51.38,39.09 v1(51.29,39.01) ; v1(52.83,6.48) 52.83,3.61 51.68,2.47 U10.10
  Bottom Layer w0.254: v1(52.83,36.05) 52.83,38.24 52.06,39.02 51.57,39.02 51.56,39.01 v1(51.29,39.01) ; v1(52.83,6.48) 53.26,6.91 53.26,20.76 v1(52.32,21.7)
PD10: length 68.8
  Top Layer w0.254: U1.79 50.88,46.61 52.07,47.81 57.15,47.81 62.74,42.22 v1(66.04,42.22) ; U12.11 55.78,6.3 55.78,7.71 57.16,9.08 57.67,9.08 v1(57.71,9.12)
  Bottom Layer w0.254: v1(57.71,9.12) 57.71,15.69 59.61,17.58 63.37,17.58 66.04,20.25 v1(66.04,42.22)
PD14: length 49.4
  Top Layer w0.254: U10.3 35.18,3.47 35.18,12.63 v1(37.97,15.42) ; v1(37.97,21.65) 38.23,21.9 38.23,37.9 38.68,38.36 47.45,38.36 47.88,38.79 47.88,40.67 U1.85
  Bottom Layer w0.254: v1(37.97,15.42) v1(37.97,21.65)
PD15: length 49.9
  Top Layer w0.254: v1(46.74,38.99) 47.38,39.63 U1.86 ; v1(43.05,35.87) 43.05,37.14 43.31,37.39 v1(46.74,37.39) ; U12.4 v1(36.45,12.25)
  Bottom Layer w0.254: v1(46.74,37.39) v1(46.74,38.99) ; v1(36.45,12.25) 36.45,14.41 33.27,17.58 33.27,34.22 33.91,34.85 42.04,34.85 v1(43.05,35.87)
PE1: length 29.8
  Top Layer w0.254: R14.1 62.24,26.23 v1(59.37,23.36) ; U1.142 36.74,22.12 v1(36.83,22.03)
  Bottom Layer w0.254: v1(59.37,23.36) 58.47,22.46 37.26,22.46 v1(36.83,22.03)
PE7: length 45.2
  Top Layer w0.254: U10.5 40.26,3.47 v1(40.26,15.17) ; v1(40.26,21.65) v1(40.26,30.92) ; v1(53.85,30.92) 54.27,30.92 54.97,31.62 U1.58
  Bottom Layer w0.254: v1(40.26,30.92) v1(53.85,30.92) ; v1(40.26,15.17) v1(40.26,21.65)
PE8: length 41.6
  Top Layer w0.254: U1.59 54.8,32.12 54.46,31.78 v1(53.34,31.78) ; v1(42.97,31.81) 42.97,23.22 v1(41.4,21.65) ; 41.02,15.04 40.64,14.66 40.64,5.62 U12.6
  Bottom Layer w0.254: v1(41.4,21.65) 41.02,21.26 41.02,15.04 ; v1(53.34,31.78) 44.18,31.78 44.11,31.86 43.62,31.86 43.57,31.91 43.08,31.91 v1(42.97,31.81)
  vias: v1(41.02,15.04)
PE9: length 44.6
  Top Layer w0.254: v1(43.87,32.44) 43.87,23.29 v1(42.19,21.62) ; U10.6 42.11,2.78 42.11,3.8 42.6,4.29 42.6,5.18 41.17,6.62 41.17,7.29 ; v1(54.1,32.57) 54.16,32.62 U1.60
  Bottom Layer w0.254: v1(43.87,32.44) 43.99,32.57 46.16,32.57 46.24,32.49 53.45,32.49 53.53,32.57 v1(54.1,32.57) ; v1(42.19,21.62) 41.61,21.03 41.61,7.84 41.17,7.4 41.17,7.29
  vias: v1(41.22,7.29)
PE10: length 42.3
  Top Layer w0.254: U12.7 v1(44.06,6.53) ; U1.63 54.97,34.12 54.61,33.76 v1(53.92,33.76) ; v1(42.96,21.47) 44.45,22.96 44.45,33.33 v1(44.84,33.72)
  Bottom Layer w0.254: v1(44.06,6.53) 41.96,8.64 41.96,20.47 v1(42.96,21.47) ; v1(44.84,33.72) 53.88,33.72 v1(53.92,33.76)
PE11: length 46.2
  Top Layer w0.254: U10.7 45.34,3.47 45.34,6.43 ; v1(45.47,34.6) 45.43,34.56 45.43,33.48 44.81,32.86 44.81,22.82 43.91,21.92 v1(43.91,21.47) ; v1(54.12,34.52) 54.88,34.52 54.89,34.54 55.85,34.54 U1.64
  Bottom Layer w0.254: v1(45.47,34.6) 45.54,34.52 v1(54.12,34.52) ; v1(43.91,21.47) 42.32,19.88 42.32,9.11 44.99,6.43 45.34,6.43
  vias: v1(45.34,6.48)
PE12: length 44.7
  Top Layer w0.254: U12.8 v1(46.61,7.17) ; U1.65 55.91,35.11 53.85,35.11 53.21,34.47 v1(53.21,33.08) ; v1(46.48,21.65) v1(46.48,33.08)
  Bottom Layer w0.254: v1(46.48,21.65) 44.91,21.65 42.67,19.41 42.67,9.25 44.76,7.17 v1(46.61,7.17) ; v1(46.48,33.08) v1(53.21,33.08)
PE13: length 47.8
  Top Layer w0.254: U10.8 48.01,3.6 v1(48.01,7.17) ; v1(47.37,21.65) 47.07,21.95 47.07,33.32 46.99,33.39 v1(46.99,35.11) ; v1(53.72,35.74) 54.85,35.74 54.97,35.62 U1.66
  Bottom Layer w0.254: v1(53.72,35.74) 53.09,35.11 v1(46.99,35.11) ; v1(47.37,21.65) 51.84,17.18 51.84,8.48 50.53,7.17 v1(48.01,7.17)
PE14: length 42
  Top Layer w0.254: v1(51,36.5) 51.13,36.63 53.85,36.63 54.36,36.12 55.93,36.12 ; v1(49.29,6.54) 49.29,5.11 49.14,4.96 U12.9 ; v1(49.14,21.65) v1(49.14,36.5)
  Bottom Layer w0.254: v1(49.14,21.65) 52.2,18.59 52.2,8.33 50.41,6.54 v1(49.29,6.54) ; v1(49.14,36.5) v1(51,36.5)
PE15: length 43.7
  Top Layer w0.254: U1.68 54.87,36.62 53.7,37.8 50.83,37.8 50.42,37.39 v1(50.42,21.52) ; v1(51.3,6.61) 50.61,5.92 50.61,3.66 U10.9
  Bottom Layer w0.254: v1(51.3,6.61) 52.55,7.86 52.55,19.39 v1(50.42,21.52)
PF11: length 34.1
  Top Layer w0.254: U1.49 53.74,27.12 52.96,26.34 52.96,21.44 55.93,18.47 59.31,18.47 60.45,17.33 60.45,13.14 63.25,10.34 63.25,3.34 U10.15
PF12: length 50.6
  Top Layer w0.254: v1(34.54,19.23) 30.61,19.23 30.17,18.8 30.17,3.54 U10.1 ; v1(53.21,27.68) 53.27,27.62 U1.50
  Bottom Layer w0.254: v1(34.54,19.23) 35.94,20.63 35.94,27.36 36.26,27.68 v1(53.21,27.68)
PG12: length 30.4
  Top Layer w0.254: v1(28.83,29.65) 34.3,29.65 U1.127 ; U12.1 v1(28.83,17.33)
  Bottom Layer w0.254: v1(28.83,17.33) 28.83,28.12 28.83,28.12 v1(28.83,29.65)
PH0: length 13.2
  Top Layer w0.254: U1.23 47.38,14.6 C35.2 45.13,10.41 X1.2
PH1: length 10.5
  Top Layer w0.254: X1.1 49.04,10.6 48.26,10.6 47.81,11.04 C36.2 47.88,12.95 U1.24
SWCLK: length 64.3
  Top Layer w0.254: v1(39.62,29.52) v1(39.62,37.52) ; U13.12 73.34,16.32 68.69,16.32 67.56,17.45 v1(67.56,24.57) ; v1(58.55,30.15) 58.8,30.41 v1(67.61,30.41) ; v1(36.12,37.77) 36.12,38.44 35.94,38.62 U1.109
  Bottom Layer w0.254: v1(58.55,30.15) 55.24,30.15 54.61,29.52 v1(39.62,29.52) ; v1(36.12,37.77) 36.37,37.52 v1(39.62,37.52) ; v1(67.56,24.57) 67.56,30.36 v1(67.61,30.41)
SWDIO: length 62.4
  Top Layer w0.254: v1(67.63,31.36) 58.8,31.36 v1(58.55,31.62) ; U13.11 75,17.2 69.34,17.2 68.2,18.34 v1(68.2,23.8) ; U1.105 37.88,38.95 36.86,37.93 v1(36.86,34.18)
  Bottom Layer w0.254: v1(67.63,31.36) 68.2,30.79 v1(68.2,23.8) ; v1(36.86,34.18) 36.86,31.14 37.72,30.28 54.42,30.28 55.75,31.62 v1(58.55,31.62)
VCAP_1: length 3.7
  Top Layer w0.254: U1.71 57.31,38.12 58.04,37.39 C31.2
VCAP_2: length 3.8
  Top Layer w0.254: U1.106 37.38,42.77 38.1,43.49 C33.2
VREF+: length 10.9
  Top Layer w0.254: U1.32 51.88,17.52 52.96,16.44 58.67,16.44 59.31,15.8 R9.2
$1N19:
  vias: v3(25.91,39.55) v3(25.91,38.41)
$1N36:
  vias: v3(15.88,18.09)
$1N53: length 1.7
  Top Layer w0.254: R10.2 26.93,24.06 LED2.2
$1N60:
  vias: v3(13.46,12.37) v3(13.46,11.1) v3(15.24,24.95)
$2N213: length 2.1
  Top Layer w0.254: LED1.2 59.04,10.07 R7.2
$4N2: length 14.5
  Bottom Layer w0.203: U8.7 58.04,55.68 58.55,56.19 61.59,56.19 62.74,55.05 68.96,55.05 69.1,55.19 69.1,56.55 CN1.1
$4N10: length 14.1
  Bottom Layer w0.203: U8.6 56.77,56.7 58.29,58.22 66.04,58.22 66.55,57.71 CN1.2
$4N201: length 9.5
  Top Layer w0.254: Q2.3 65.89,16.4 BUZZER1.2
$4N202: length 3.3
  Top Layer w0.254: Q2.1 63.75,23.27 R15.2 R14.2

## Copper pours and planes (outline as drawn; the poured copper is in the pictures)
3.3V on POWER: 24.64,53.06 79.74,53.06 79.74,6.79 24.64,6.79
5V on Top Layer: 19.68,54.67 23.49,54.67 23.88,54.28 23.88,53.27 24.53,52.01 33.48,52.04 34.96,51.37 34.96,50.64 34.67,50.35 33.48,50.35 33.14,50.01 33.14,49.74 33.54,49.35 34.59,49.35 34.83,49.11 34.83,48.48 34.67,48.32 32.77,48.32 32.51,48.57 32.51,49.1 31.64,49.97 29.73,49.97 28.73,50.97 27.54,50.97 27.3,50.73 27.3,48.06 27.05,47.81 26.28,47.81 26.04,48.04 26.04,50.5 25.79,50.75 21.7,50.75 19.42,53.03 19.42,54.4
5V on Top Layer: 19.81,54.67 19.89,54.59 23.54,54.59 23.54,53.19 18.44,48.09 18.44,47.09 18.16,46.81 18.16,46.79 16.89,46.79 16.32,47.36 16.32,48.13 19.34,51.14 19.34,54.24 19.76,54.67
5V on Top Layer: 24.64,51.11 27.07,51.11 27.43,50.75 27.43,49.92 27.15,49.64 24.71,49.64 24.4,49.95 24.4,50.87
5V on Top Layer: 27.43,51.62 27.43,47.81 27.3,47.68 26.54,47.68 26.42,47.81 26.16,47.81 26.11,47.86 26.11,50.43 25.79,50.75 21.57,50.75 19.31,53.01 19.31,53.9 20.2,54.79 23.37,54.79 24.13,54.03 24.13,52.76 24.64,52.25 26.8,52.25
5V on Bottom Layer: 25.27,50.73 27.05,50.73 27.43,50.35 27.43,48.06 29.08,46.41 29.08,40.7 28.7,40.31 27.03,40.31 26.78,40.56 25.79,40.56 25.4,40.95 25.4,49.53 25.14,49.79 25.14,50.59
5V on POWER: 11.18,59.74 79.74,59.74 79.74,41.45 11.18,41.45
5V_5A on Top Layer: 27.55,17.07 28.28,17.07 28.51,16.84 28.51,15.86 28.19,15.55 28.19,13.52 27.21,12.54 26.89,12.54 26.89,12.46 26.67,12.25 26.67,11.69 26.43,11.45 21.81,11.45 21.46,11.1 21.46,8.56 21.21,8.31 19.68,8.31 19.43,8.56 19.43,12.06 19.68,12.31 21.04,12.54 21.99,13.09 25.22,13.09 25.65,13.52 25.65,14.03 27.12,15.49 27.12,16.9 27.29,17.07 27.55,17.07
5V_5A on Top Layer: 21.99,9.83 23.28,9.83 23.75,9.37 23.75,7.13 23.4,6.79 22.23,6.79 21.91,7.1 19.88,7.1 18.92,8.06 18.92,11.99 19.43,12.5 20.68,12.5 21.26,13.09 21.99,13.09
5V_5A on Bottom Layer: 27.56,9.58 27.56,4.11 27.3,3.85 23.63,3.85 23.24,4.25 22.73,4.25 22.1,4.88 22.1,6.91 21.72,7.29 21.72,8.95 22.35,9.58
5V_5A on POWER: 0.26,44.25 79.74,44.25 79.74,0.26 0.26,0.26
GND-D on Top Layer: -2.41,62.03 80.26,62.03 80.26,-1.09 -2.41,-1.09
GND-D on Bottom Layer: -1.14,60.25 81.03,60.25 81.03,-1.21 -1.14,-1.21
GND-D on GND: 0.26,59.74 79.74,59.74 79.74,0.26 0.26,0.26
VIN-D on Top Layer: 23.11,43.29 23.95,43.29 24.13,43.11 24.13,41.01 24.69,40.45 24.69,36.7 25.15,36.25 26.16,36.25 26.42,36 26.42,31.04 26.16,30.79 24.14,30.79 23.87,31.06 23.87,36.13 23.24,36.76 23.24,40.4 22.93,40.7 22.93,43.12
VIN-D on Top Layer: 24.01,35.11 24,35.11 24,36.38 24.03,36.41 26.13,36.41 26.54,36 26.54,35.49 26.16,35.11
VIN-D on Top Layer: 24,27.49 24,36.12 24.13,36.25 25.91,36.25 26.29,35.87 26.16,35.74 26.16,25.58 25.82,25.24 23.21,25.24 22.83,24.86 22.83,18.85 21.72,18.85 21.59,18.98 21.59,26.22 22.1,26.73 23.24,26.73
VIN-D on Top Layer: 24.64,37.56 26.13,37.56 26.13,36.06 24.96,36.06 24.64,36.38
VIN-D on POWER: 11.18,42.78 28.09,42.78 28.09,19.17 11.18,19.17
VIN-P on Top Layer: 11.43,35.74 8.38,33.96 6.86,32.8 6.86,29.55 10.29,28.38 11.56,27.11 11.56,21.14 11.05,20.63 5.08,20.63 4.19,21.52 1.52,21.52 0.63,22.41 0.63,42.35 1.19,45.53 11.43,45.53
VIN-P on Top Layer: 10.65,27.61 11.43,26.83 11.43,21.39 10.8,20.76 10.41,20.76 9.52,19.87 9.52,17.96 8.64,17.07 7.75,17.07 7.24,16.57 7.24,10.6 6.73,10.09 1.78,10.09 0.76,11.1 0.76,26.47 1.91,27.61
VIN-P on POWER: 0.26,59.74 10.92,59.74 10.92,7.42 0.26,7.42
EN_1 on Top Layer: 19.76,39.53 19.96,39.32 19.96,38.64 19.69,38.37 16.54,38.37 16.4,38.51 16.4,39.44 16.51,39.55 16.54,39.53
FB1 on Top Layer: 20.7,48.44 21.21,48.44 21.46,48.19 21.46,46.28 21.1,45.92 20.41,45.92 20.41,45.72 19.96,45.28 17.26,45.28 17.02,45.52 17.12,45.62 17.12,46.46 19.98,46.46 20.19,46.66 20.19,47.93
FB2 on Top Layer: 26.9,18.85 26.9,15.75 26.31,15.17 25.28,15.17 25.28,13.78 24.89,13.39 24.51,13.39 24.13,13.77 24.13,15.4 24.59,15.85 25.52,15.85 25.74,16.07 25.74,18.68 25.91,18.85 25.91,18.85
$1N16 on Top Layer: 20.57,31.46 20.27,31.15 18.82,31.15 18.42,31.55 18.54,32.19 20.57,32.28 20.7,31.93 20.7,31.55 20.57,31.42
$1N16 on Top Layer: 21.86,27.22 21.86,30.67 22.1,30.92 23.11,30.92 23.3,30.73 23.3,27.08 23.2,26.98 22.1,26.98
$1N16 on Top Layer: 18.54,32.06 20.57,32.06 20.7,31.93 20.7,31.17 20.83,31.04 22.99,31.04 23.35,30.68 23.35,28.87 23.24,28.76 22.23,28.76 21.83,29.15 21.83,30.17 21.72,30.28 20.7,30.28 19.86,31.12 18.72,31.12 18.42,31.42 18.42,31.93
$1N19 on Top Layer: 24.77,40.7 24.51,40.95 24.51,42.6 24.56,42.65 24.56,42.82 25.11,42.82 26.58,44.29 27.58,44.29 27.8,44.07 27.8,43.17 28.23,42.73 28.83,42.73 28.96,42.6 28.96,40.57 28.89,40.51 27.43,40.51 27.43,40.44 27.3,40.57 27.3,43.36 27.21,43.27 26.25,43.27 25.27,42.29 25.27,41.2
$1N19 on Top Layer: 24.38,42.98 24.45,43.05 25.46,43.05 25.46,41.4 26.55,40.3 26.59,37.71 25.38,37.71 25.3,40.03 24.38,40.95
$1N19 on Bottom Layer: 25.49,40.73 26.42,39.81 26.42,38.16 26.16,37.9 25.63,37.9 25.38,38.16 25.38,39.53 25.17,39.74 17.67,39.74 16.81,40.61 13.8,40.61 13.59,40.82 13.59,46.28 16.76,46.28 16.89,46.16 16.89,42.09 18.25,40.73
$1N20 on Top Layer: 24.51,48.44 25.27,48.44 25.4,48.32 25.4,46.48 25.58,46.3 27.05,46.3 27.49,45.87 27.49,44.82 27.43,44.76 25.75,44.76 25.46,45.05 25.46,45.33 24.89,45.9 24.51,45.9 24.26,46.16 24.26,48.19
$1N35 on Top Layer: 17.7,16.79 17.7,16.82 19.43,16.82 20.32,15.93 21.21,15.93 21.46,15.68 21.46,13.52 21.35,13.41 20.74,13.41 20.32,13.83 20.32,15.17 20.19,15.3 17.97,15.3 17.8,15.47 17.8,16.7
$1N36 on Top Layer: 14.88,22.53 14.86,22.53 14.99,22.66 20.7,22.66 21.34,22.03 21.34,19.23 21,18.9 19.94,18.9 19.71,18.66 19.71,17.39 19.52,17.2 15.49,17.2 14.88,17.81
$1N36 on Bottom Layer: 15.24,4.08 11.94,4.08 11.94,9.47 14.1,9.71 15.09,18.6 17.14,18.6 17.17,17.35 16.26,16.06
$1N46 on Top Layer: 35.81,50.47 35.81,51.23 35.95,51.36 38.05,51.36 38.43,51.74 39.12,51.74 39.37,51.49 39.37,48.44 39.3,48.37 38.42,48.37 38.23,48.56 38.23,50.22 38.1,50.35 35.94,50.35
$1N60 on Top Layer: 9.14,16.44 11.05,18.34 11.05,19.87 11.84,20.66 11.84,30.95 12.7,31.81 16.64,31.81 16.76,31.68 16.76,24.44 16.02,23.69 14.88,23.69 14.6,23.42 14.6,10.6 14.22,10.22 10.03,10.22 9.14,11.1
$1N60 on Top Layer: 20.7,36.12 20.6,32.58 18.4,32.8 17.54,31.44 17.54,31.2 17.85,30.89 20.05,30.89 20.24,30.7 20.24,28.17 19.81,27.74 13.33,27.74 13.08,28 13.08,30.92 13.46,31.3 13.46,32.58 13.84,32.96 16.52,32.96 17.91,34.35 17.91,36 18.05,36.14 18.08,36.12
$1N60 on POWER: 8.06,36.63 23.52,36.63 23.52,7.94 8.06,7.94
$4N202 on Top Layer: 63.26,26.79 64.38,26.79 64.38,22.93 64.52,22.79 63.26,22.79

Small or netless copper shapes (teardrops, artwork), in the pictures only: 2 on Top Layer, 1 on Bottom Layer
